# Altium project distributeur.PrjPCB
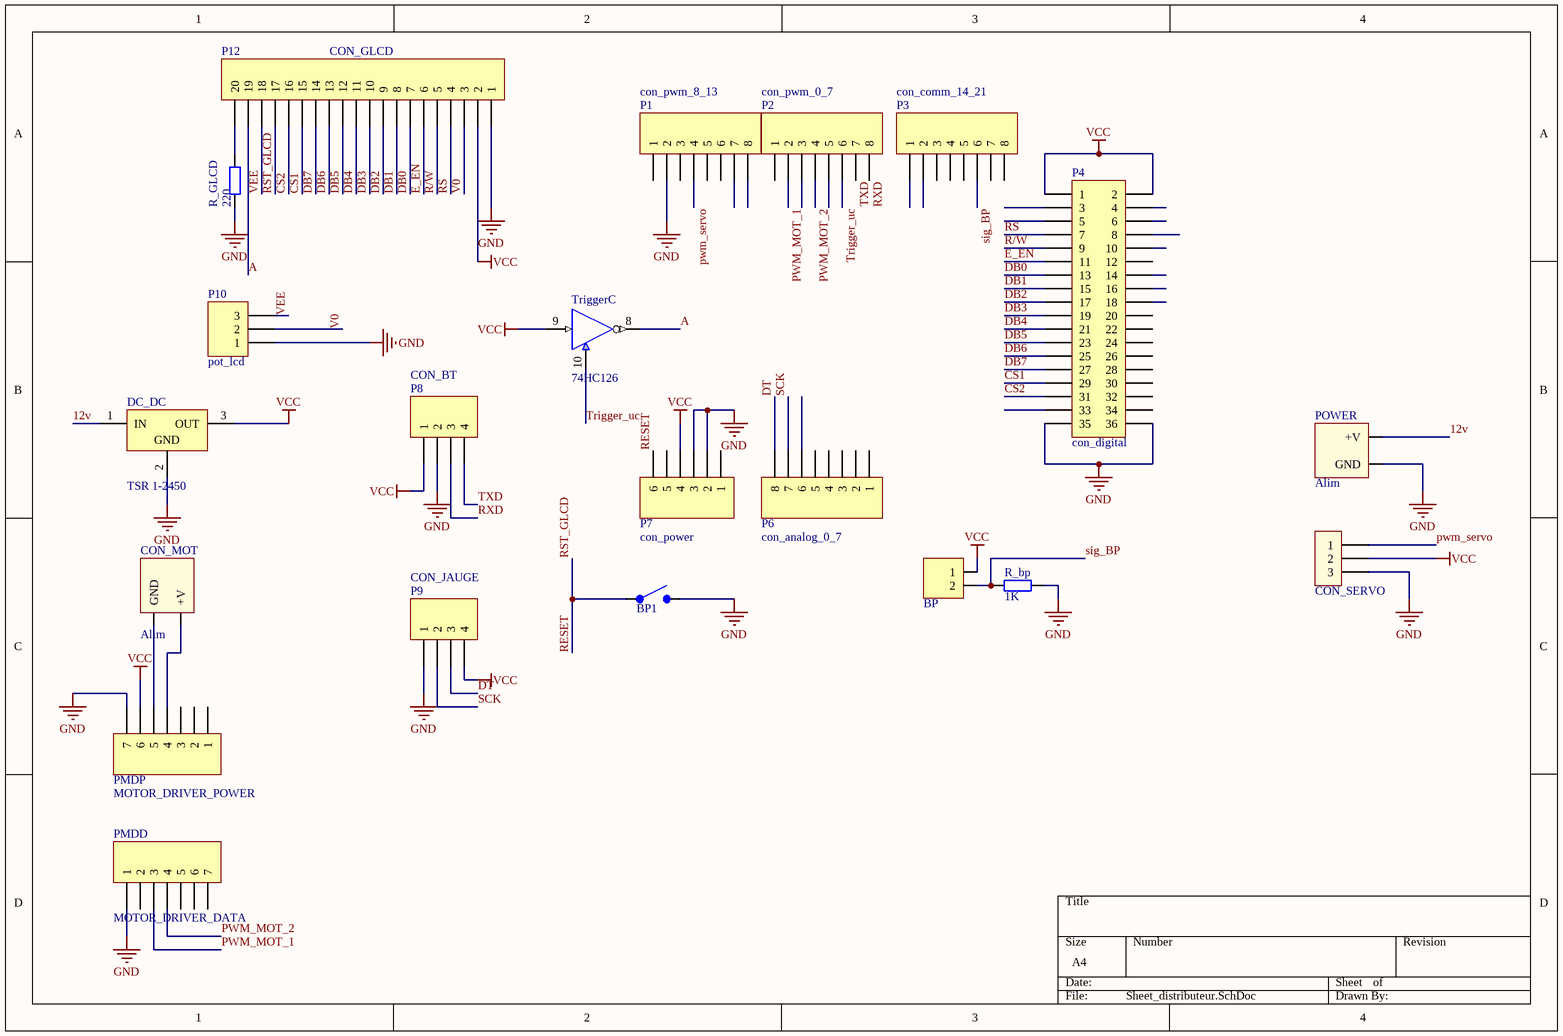
[diagram p0: Sheet_distributeur.SchDoc]
1 sheet, 21 parts. Net scope: global (net labels, ports and power ports of the same name join across sheets).
Board file: PCBdis.PcbDoc

## Sheet Sheet_distributeur.SchDoc
size A4

### Parts
BP  Connecteur bipastille  [Conn_SIG_2pts]  (value not drawn)
BP1  BP  [BP_1]  (value not drawn)
CON_MOT  Alim  [Miniconnect 2pts]
CON_SERVO  Connecteur Autocom 3pts  [Autocom HE14 - 3 - Coudé]  (value not drawn)
DC_DC  TSR 1-2450  [TSR-1]
P1  con_pwm_8_13  [HDR1X8]
P2  con_pwm_0_7  [HDR1X8]
P3  con_comm_14_21  [HDR1X8]
P4  con_digital  [HDR2X18]
P6  con_analog_0_7  [HDR1X8]
P7  con_power  [HDR1X6]
P8  CON_BT  [HDR1X4]
P9  CON_JAUGE  [HDR1X4]
P10  pot_lcd  [HDR1X3]
P12  CON_GLCD  [HDR1X20]
PMDD  MOTOR_DRIVER_DATA  [HDR1X7]
PMDP  MOTOR_DRIVER_POWER  [HDR1X7]
POWER  Alim  [Miniconnect 2pts]
R_bp  1K  [Axial_4]
R_GLCD  220  [AXIAL-0.4]
Trigger  74HC126  [DIP_14]  (part C of 4)

### Nets
GND: BP1.2 CON_SERVO.3 DC_DC.2(GND) P1.2 P4.35 P4.36 P7.2 P7.3 P8.2 P9.1 P10.1 P12.1 PMDD.1 PMDP.7 POWER.1(GND) R_bp.2 R_GLCD.1
VCC: BP.1 CON_SERVO.2 DC_DC.3(OUT) P4.1 P4.2 P7.4 P8.1 P9.4 P12.2 PMDP.6 Trigger.9(3A)
12v: DC_DC.1(IN) POWER.2(+V)
A: P12.19 Trigger.8(3Y)
CS1: P4.29 P12.15
CS2: P4.31 P12.16
DB0: P4.13 P12.7
DB1: P4.15 P12.8
DB2: P4.17 P12.9
DB3: P4.19 P12.10
DB4: P4.21 P12.11
DB5: P4.23 P12.12
DB6: P4.25 P12.13
DB7: P4.27 P12.14
DT: P6.8 P9.3
E_EN: P4.11 P12.6
PWM_MOT_1: P2.2 PMDD.3
PWM_MOT_2: P2.4 PMDD.4
pwm_servo: CON_SERVO.1 P1.4
R/W: P4.9 P12.5
RESET: BP1.1 P7.6 P12.17  [also labelled RST_GLCD]
RS: P4.7 P12.4
RXD: P2.8 P8.3
SCK: P6.7 P9.2
sig_BP: BP.2 P3.6 R_bp.1
Trigger_uc: P2.6 Trigger.10(3OE)
TXD: P2.7 P8.4
V0: P10.2 P12.3
VEE: P10.3 P12.18
NetCON_MOT_1: CON_MOT.1(GND) PMDP.5
NetCON_MOT_2: CON_MOT.2(+V) PMDP.4
NetP12_20: P12.20 R_GLCD.2

Not connected (* = marked no-connect by the designer): P1 1 3 5 6 7 8; P2 1 3 5; P3 1 2 3 4 5 7 8; P4 3 4 5 6 8 10 12 14 16 18 20 22 24 26 28 30 32 33 34; P6 1 2 3 4 5 6; P7 1 5; PMDD 2 5 6 7; PMDP 1 2 3; Trigger 7(GND) 14(VCC)

### Library data of the parts
BP = Connecteur bipastille: Double pastilles pour souder un moteur
BP1 = BP: Bouton poussoir pour CI; Manufacturer: TE CONNECTIVITY; Manufacturer Part Number: FSM101; Configuration des contacts: SPST; Fonctionnement de commutation: Off-(On); Style d'actionneur: Rond; Terminaisons commutateur: Through Hole; Couleur levier / capuchon: Noir; Courant de contact max.: 50; Série: FSM100-104; Tension, contact c.c.: 12; Courant, Commutation c.c. min.: 10; Diamètre, axe: 3.5; Durée de vie, mécanique: 100000; Force diélectrique, Vca: 500; Force, fonctionnement: 1.57; Largeur (externe): 6; Longueur, axe: 3.4; Longueur/hauteur: 3.57; Matière: Glass Filled PPS; Résistance, contact, max..: 100; Température de fonctionnement max..: 85; Température d'utilisation min: -35; Tension, contact c.c. min.: 1; Type de borne: CMS; Supplier 1: Farnell; Supplier Part Number 1: 1813631; RoHS: YES; Stock 1: 1007; Pricing 1: 1=0,49, 10=0,47, 50=0,45, 100=0,42 (EUR); Contact Configuration: SPST; Contacts: Off-(On); Type d'actionnement: Rond; ComponentLink1URL: http://www.tycoelectronics.com/commerce/DocumentDelivery/DDEController?Action=srchrtrv&DocNm=1571140&DocType=Customer+Drawing&DocLang=English; ComponentLink1Description: Datasheet Tyco Electronics (trou traversant); ComponentLink2URL: http://www.farnell.com/datasheets/1500792.pdf; ComponentLink2Description: Datasheet TE Connectivity (trou traversant); Supplier 2: Farnell; Supplier Part Number 2: 1555991; Stock 2: 41186; Pricing 2: 25=0,41, 100=0,4, 500=0,35, 1000=0,33, 5000=0,3, 10000=0,27 (EUR); Contact Material: Alliage de cuivre; Contact Plating: Silver over Nickel; Couleur: Noir; Courant, Commutation c.a.max.: 50; Profondeur: 6; Résistance, isolation: 100; Tension, résistance d'isolation: 100; Type de terminaison: CMS; ComponentLink3URL: http://www.tycoelectronics.com/commerce/DocumentDelivery/DDEController?Action=srchrtrv&DocNm=2-1437565-7&DocType=Customer+Drawing&DocLang=English; ComponentLink3Description: Datasheet Tyco Electronics (CMS)
CON_MOT POWER = Connecteur Alimentation: Connecteur d'alimentation; Manufacturer: IMO PRECISION CONTROLS; Manufacturer Part Number: 21.95MH/2; Supplier 1: Farnell; Supplier Part Number 1: 9633197; RoHS: YES; Stock 1: 1666; Pricing 1: 1=0,36, 25=0,35, 100=0,31, 250=0,29, 500=0,27 (EUR); ComponentLink1URL: http://www.farnell.com/cad/80517.pdf; ComponentLink1Description: http://www.farnell.com/cad/80517.pdf
CON_SERVO = Connecteur Autocom 3 pts: connecteur autocom HE14 3 pts; Manufacturer: TE CONNECTIVITY / AMP; Manufacturer Part Number: 281698-3; Type de connecteur: Contact fil-à-carte; Terminaison du contact: Traversant à angle droit; Genre: Embase; Nombre de contacts: 3; Nombre de rangées: 1; Pas: 2.54; Plaquage du contact: Etain; Matériau du contact: Bronze phosphoreux; Approval Bodies: HE / NFC; Couleur: Bleu; Inflammabilité: UL94V-0; Longueur/hauteur: 7.62; Matière: Polyester chargé verre; Méthode de terminaison: A souder; Nombre de cycles d'accouplements: 30; Résistance d'isolement: 1000; Température de fonctionnement max..: 105; Température d'utilisation min: -40; Tension, fonctionnement: 500; Supplier 1: Farnell; RoHS: YES; Stock 1: 9361; Pricing 1: 5=0,44, 100=0,36, 250=0,3 (EUR); Série: HE14; Courant: 3; Diamètre de perçage du circuit imprimé: 1; Force de désaccouplement: 3; Nombre de pôles: 3; Nombre de voies: 3; Résistance, contact: 30; ComponentLink1URL: http://www.tycoelectronics.com/commerce/DocumentDelivery/DDEController?Action=srchrtrv&DocNm=CVM_281698-3&DocType=Customer+View+Model&DocLang=3D; ComponentLink1Description: http://www.tycoelectronics.com/commerce/DocumentDelivery/DDEController?Action=srchrtrv&DocNm=CVM_281698-3&DocType=Customer+View+Model&DocLang=3D; ComponentLink2URL: http://www.tycoelectronics.com/commerce/DocumentDelivery/DDEController?Action=srchrtrv&DocNm=281698&DocType=Customer+Drawing&DocLang=English; ComponentLink2Description: http://www.tycoelectronics.com/commerce/DocumentDelivery/DDEController?Action=srchrtrv&DocNm=281698&DocType=Customer+Drawing&DocLang=English; ComponentLink3URL: http://www.tycoelectronics.com/commerce/DocumentDelivery/DDEController?Action=srchrtrv&DocNm=108-15053&DocType=Specification+Or+Standard&DocLang=French; ComponentLink3Description: http://www.tycoelectronics.com/commerce/DocumentDelivery/DDEController?Action=srchrtrv&DocNm=108-15053&DocType=Specification+Or+Standard&DocLang=French; ComponentLink4URL: http://www.farnell.com/datasheets/23840.pdf; ComponentLink4Description: http://www.farnell.com/datasheets/23840.pdf; Supplier Part Number 1: 1205991
DC_DC = TSR 1-2450: DC/DC Converters  TSR-1 Series, 1 A; Manufacturer: TRACOPOWER; DC / DC Converter O/P Type: Fixed; Tension d'entrée: 6.5V DC à 36; Tension, sortie: 5.0; Courant, sortie: 1; Type de convertisseur DC / DC: SIP; Convertisseur DC / DC de montage: Traversant; Tension, entrée max..: 36; Tension, entrée min.: 6.5; Type de montage: PCB; Publisher: H.Angelis; Supplier 1: Farnell; Supplier Part Number 1: 1696320; Manufacturer Part Number: TSR 1-2450; RoHS: YES; Stock 1: 3108; Pricing 1: 1=8,45, 5=7,66, 10=7,43, 25=7,21 (EUR); ComponentLink1URL: http://www.farnell.com/datasheets/574984.pdf; ComponentLink1Description: http://www.farnell.com/datasheets/574984.pdf
P1-P3 P6 = Header 8: Header, 8-Pin; LatestRevisionDate: 17-Jul-2002; LatestRevisionNote: Re-released for DXP Platform.; Publisher: Altium Limited
P4 = Header 18X2: Header, 18-Pin, Dual row; LatestRevisionDate: 17-Jul-2002; LatestRevisionNote: Re-released for DXP Platform.; Publisher: Altium Limited
P7 = Header 6: Header, 6-Pin; LatestRevisionDate: 17-Jul-2002; LatestRevisionNote: Re-released for DXP Platform.; Publisher: Altium Limited
P8 P9 = Header 4: Header, 4-Pin; LatestRevisionDate: 17-Jul-2002; LatestRevisionNote: Re-released for DXP Platform.; Publisher: Altium Limited
P10 = Header 3: Header, 3-Pin; LatestRevisionDate: 17-Jul-2002; LatestRevisionNote: Re-released for DXP Platform.; Publisher: Altium Limited
P12 = Header 20: Header, 20-Pin; LatestRevisionDate: 17-Jul-2002; LatestRevisionNote: Re-released for DXP Platform.; Publisher: Altium Limited
PMDD PMDP = Header 7: Header, 7-Pin; LatestRevisionDate: 17-Jul-2002; LatestRevisionNote: Re-released for DXP Platform.; Publisher: Altium Limited
R_bp = Res: Resistance; Published: 8-Jun-2000; Revision: July-2002: Re-released for DXP Platform.; Publisher: Altium Limited; Supplier 2: Farnell; Supplier Part Number 2: 2057836; Value: 1K
R_GLCD = Res2: Resistor; Value: 1K; Published: 8-Jun-2000; LatestRevisionDate: 17-Jul-2002; LatestRevisionNote: Re-released for DXP Platform.; PackageReference: AXIAL-0.4; Publisher: Altium Limited; PackageDescription: Axial Device, Thru-Hole; 2 Leads; 0.4 in Pin Spacing
Trigger = 74XX126: Quad Buffer/line driver; 3-state; Type de buffer: Mémoire tampon, Non inverseur; Nombre de broches: 14; SVHC: No SVHC (19-Dec-2011); Fonction logique: Quadruple Bus Buffer with 3; Numéro de base de la fonction logique: 74126; Nombre d'entrées: 1; Nombre de portes: 4; ComponentLink1URL: http://www.ti.com/lit/ds/symlink/sn74hc126.pdf; ComponentLink1Description: Datasheet famille HC; componentLink2URL: http://www.ti.com/lit/ds/symlink/sn74hct126.pdf; ComponentLink2Description: Datasheet famille HCT; componentLink3URL: http://www.ti.com/lit/ds/symlink/sn74ls126a.pdf; ComponentLink3Description: Datasheet famille LS; Supplier 1: Farnell; Supplier Part Number 1: 1739684; RoHS: YES; Stock 1: 995; Pricing 1: 1=0,75, 10=0,56, 100=0,46 (EUR); Racine de la référence: 74126; ComponentLink7URL: http://www.farnell.com/datasheets/1360268.pdf; ComponentLink7Description: TI : 74HC126 / 74HCT126; ComponentLink10URL: http://www.farnell.com/datasheets/89049.pdf; ComponentLink10Description: FAIRCHILD : 74HC125 / 74HC126; ComponentLink11URL: http://www.farnell.com/datasheets/410597.pdf; ComponentLink11Description: REACH